# Altium schematic sheet USB Hub.SchDoc: ET4X Full Dock
size A; Date: 12/7/2021; ApprovedBy: KEW; CheckedBy: KEW; Author: KEW; CompanyName: Gamber-Johnson LLC; Engineer: KEW; Organization: Gamber-Johnson LLC; Address1: 5001 Joerns Dr.; Address2: Stevens Point; Address3: WI, 54481; DocumentNumber: TBD; DrawnBy: KEW; RevisionEngineer: KEW; ProjectTitle: USB-OTG Puck; Revision: X2; SheetNumber: 2; SheetTotal: 5; RevisionDescription: Genesys USB2.0 hub; DrawnByDate: 1/18/2023; ProjectNumber: 7150-0297; AssemblyNumber: 7150-0297; RevisionDate: 1/18/2023; SheetTitle: USB Hub; Time: 1:27 PM; Application_BuildNumber: TBD
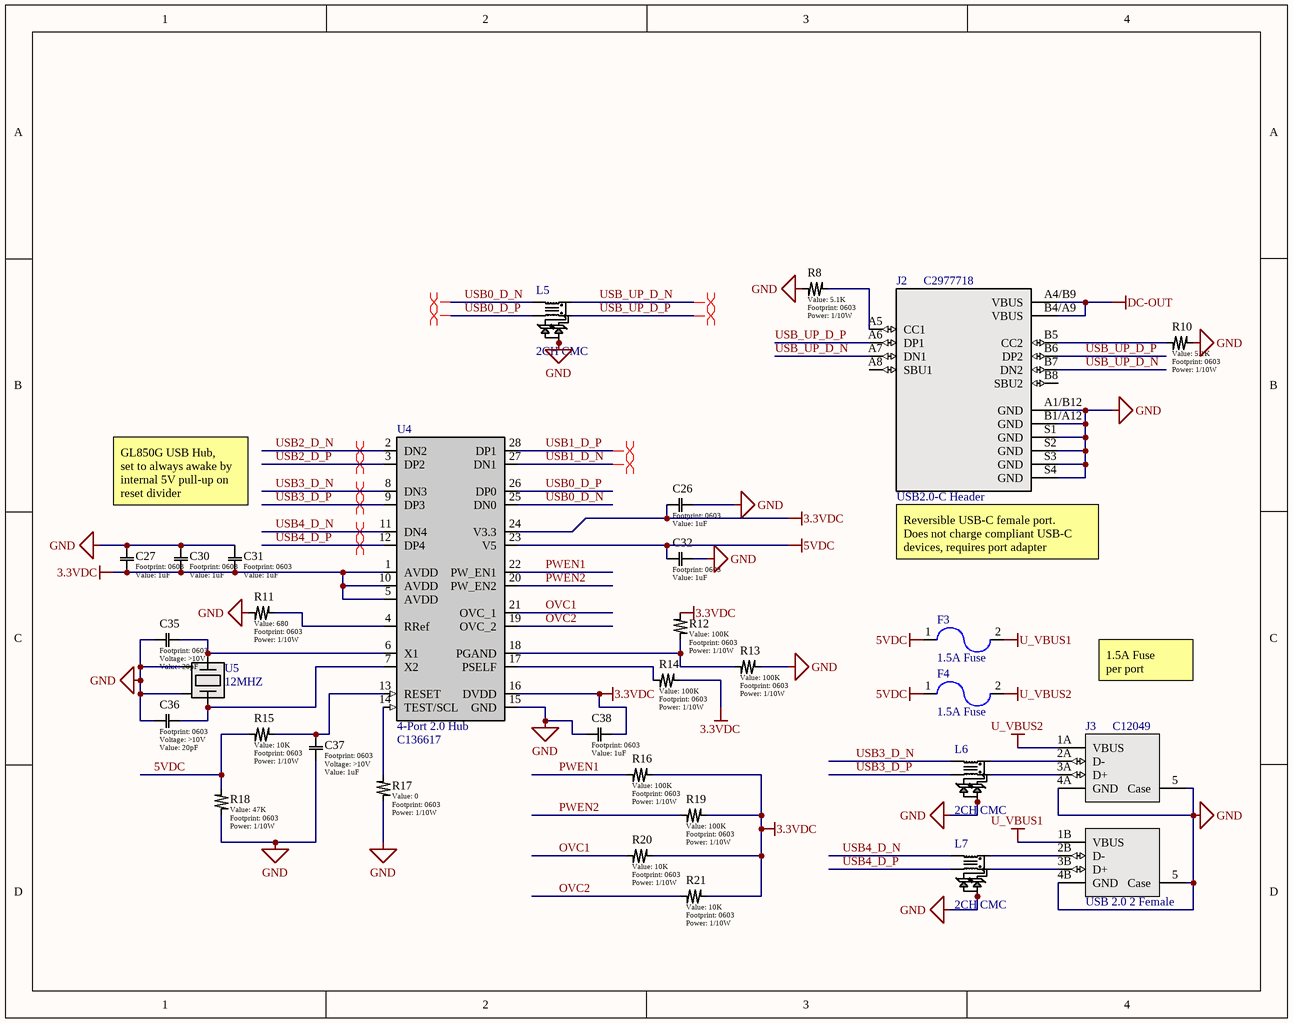
[diagram p0: USB Hub.SchDoc]

## Parts
C26  value 1uF  [0603]  (hidden comment: Generic Capacitor)
C27  value 1uF  [0603]  (hidden comment: Generic Capacitor)
C30  value 1uF  [0603]  (hidden comment: Generic Capacitor)
C31  value 1uF  [0603]  (hidden comment: Generic Capacitor)
C32  value 1uF  [0603]  (hidden comment: Generic Capacitor)
C35  value 20pF  Voltage: >10V  [0603]  (hidden comment: Generic Capacitor)
C36  value 20pF  Voltage: >10V  [0603]  (hidden comment: Generic Capacitor)
C37  value 1uF  Voltage: >10V  [0603]  (hidden comment: Generic Capacitor)
C38  value 1uF  [0603]  (hidden comment: Generic Capacitor)
F3  1.5A Fuse  [1206 Fuse]
F4  1.5A Fuse  [1206 Fuse]
J2  USB2.0-C Header  LCSC PN: C2977718  [USB4110-GF-A]
J3  USB 2.0 2 Female  LCSC PN: C12049  [907-111A1022D10200]
L5  2CH CMC  [SMD-6-2CH]
L6  2CH CMC  [SMD-6-2CH]
L7  2CH CMC  [SMD-6-2CH]
R8  value 5.1K  Power: 1/10W  [0603]  (hidden comment: Generic Resistor)
R10  value 5.1K  Power: 1/10W  [0603]  (hidden comment: Generic Resistor)
R11  value 680  Power: 1/10W  [0603]  (hidden comment: Generic Resistor)
R12  value 100K  Power: 1/10W  [0603]  (hidden comment: Generic Resistor)
R13  value 100K  Power: 1/10W  [0603]  (hidden comment: Generic Resistor)
R14  value 100K  Power: 1/10W  [0603]  (hidden comment: Generic Resistor)
R15  value 10K  Power: 1/10W  [0603]  (hidden comment: Generic Resistor)
R16  value 100K  Power: 1/10W  [0603]  (hidden comment: Generic Resistor)
R17  value 0  Power: 1/10W  [0603]  (hidden comment: Generic Resistor)
R18  value 47K  Power: 1/10W  [0603]  (hidden comment: Generic Resistor)
R19  value 100K  Power: 1/10W  [0603]  (hidden comment: Generic Resistor)
R20  value 10K  Power: 1/10W  [0603]  (hidden comment: Generic Resistor)
R21  value 10K  Power: 1/10W  [0603]  (hidden comment: Generic Resistor)
U4  4-Port 2.0 Hub  LCSC PN: C136617  [GL850G-HHY22]
U5  12MHZ  [SMD2520-4P]

## Nets
3.3VDC: C26.1 C27.1 C30.1 C31.1 C38.2 R12.2 R14.2 R16.2 R19.2 R20.2 R21.2 U4.1(AVDD) U4.5(AVDD) U4.10(AVDD) U4.16(DVDD) U4.24(V3.3)
5VDC: C32.1 F3.1 F4.1 R15.1 R18.1 U4.23(V5)
DC-OUT: J2.A4/B9(VBUS) J2.B4/A9(VBUS)
GND: C26.2 C27.2 C30.2 C31.2 C32.2 C35.2 C36.2 C37.1 C38.1 J2.A1/B12(GND) J2.B1/A12(GND) J2.S1(GND) J2.S2(GND) J2.S3(GND) J2.S4(GND) J3.4A(GND) J3.4B(GND) J3.5(Case) L5.5 L5.6 L6.5 L6.6 L7.5 L7.6 R8.1 R10.2 R11.2 R13.2 R17.2 R18.2 U4.15(GND) U5.2(GND) U5.4(GND)
U_VBUS1: F3.2 J3.1B(VBUS)
U_VBUS2: F4.2 J3.1A(VBUS)
OVC1: R20.1 U4.21(OVC_1)
OVC2: R21.1 U4.19(OVC_2)
PWEN1: R16.1 U4.22(PW_EN1)
PWEN2: R19.1 U4.20(PW_EN2)
USB0_D_N: L5.4 U4.25(DN0)
USB0_D_P: L5.3 U4.26(DP0)
USB1_D_N: U4.27(DN1)
USB1_D_P: U4.28(DP1)
USB2_D_N: U4.2(DN2)
USB2_D_P: U4.3(DP2)
USB3_D_N: L6.4 U4.8(DN3)
USB3_D_P: L6.3 U4.9(DP3)
USB4_D_N: L7.4 U4.11(DN4)
USB4_D_P: L7.3 U4.12(DP4)
USB_UP_D_N: J2.A7(DN1) J2.B7(DN2) L5.1
USB_UP_D_P: J2.A6(DP1) J2.B6(DP2) L5.2
NetC35_1: C35.1 U4.6(X1) U5.1
NetC36_1: C36.1 U4.7(X2) U5.3
NetC37_2: C37.2 R15.2 U4.13(RESET)
NetJ2_A5: J2.A5(CC1) R8.2
NetJ2_B5: J2.B5(CC2) R10.1
NetJ3_2A: J3.2A(D-) L6.1
NetJ3_2B: J3.2B(D-) L7.1
NetJ3_3A: J3.3A(D+) L6.2
NetJ3_3B: J3.3B(D+) L7.2
NetR11_1: R11.1 U4.4(RRef)
NetR12_1: R12.1 R13.1 U4.18(PGAND)
NetR14_1: R14.1 U4.17(PSELF)
NetR17_1: R17.1 U4.14(TEST/SCL)

Not connected (* = marked no-connect by the designer): J2 A8(SBU1) B8(SBU2)

## Layout directives
differential pair: USB0_D_N, USB0_D_P, USB1_D_N, USB1_D_P, USB2_D_N, USB2_D_P, USB3_D_N, USB3_D_P, USB4_D_N, USB4_D_P, USB_UP_D_N, USB_UP_D_P

## Notes on the sheet
- GL850G USB Hub,
  set to always awake by internal 5V pull-up on reset divider
- (near J2) Reversible USB-C female port.
  Does not charge compliant USB-C devices, requires port adapter
- 1.5A Fuse
  per port
- REV
- REVISIONS
- DATE
- DESCRIPTION
- BY
- UNLESS OTHERWISE SPECIFIED, DRAWING DEFINITIONS AND TOLERANCES SHALL BE FOUND UNDER SUPPLIER STANDARDS SS-001. THIS PART AND ALL COMPONENTS OF IT MUST BE RoHS & REACH COMPLIANT. A CERTIFICATE OF COMPLIANCE MUST BE PROVIDED UPON REQUEST.
- ALL INFORMATION ON THIS DOCUMENT IS THE SOLE PROPERTY OF GAMBER-JOHNSON AND SHALL NOT BE COPIED, REPRODUCED, USED OR DISCLOSED IN WHOLE OR IN PART WITHOUT THE WRITTEN CONSENT OF GAMBER-JOHNSON
- TOLERANCES
  .00 ± .060
  .000 ± .020
  .0000 ± .005
  ANGELS ± 1°
- DRAWN BY:
- PROJECT NUMBER:
- SHEET TITLE:
- SHEET
- OF
- DATE:
- LOCATION:
- ASSEMBLY NUMBER
- SIZE
- GAMBER-JOHNSON LLC
  3001 BORHAM AVE.
  STEVENS POINT, WI 54481
  +1 (715) 344-5209
- B

## Library data of the parts
C26 C27 C30-C32 C38 = Generic Capacitor: Voltage: >10V; Tolerance: 10%
C35-C37 = Generic Capacitor: Tolerance: 10%
F3 F4 = ASMD1206-075: 6V 750mA 100A 600mW -40℃~+85℃ 1.5A 90mΩ 200ms 500mΩ 1206 Resettable Fuses ROHS; LCSC PN: C135339
J2 = USB4110-GF-A: USB-C (USB TYPE-C) USB 2.0 Receptacle Connector 24 (16+8 Dummy) Position Surface Mount, Right Angle; Through Hole; Manufacturer 1: Global Connector Technology; Supplier 1: Newark; Manufacturer Part Number 1: USB4110-GF-A; RoHS: No; Pricing 1: 1=1.09000, 10=0.97500, 25=0.90200, 50=0.83800, 100=0.72900, 250=0.66000, 500=0.58700, 1000=0.56700 (USD); Supplier Part Number 1: 86AH2022
J3 = 907-111A1022D10200: USB 2.0 2 8 Female Type-A Plugin USB Connectors ROHS
L5-L7 = ICMEF112P350MFR: 35Ω@100MHz -40℃~+85℃ 4Ω 5V 2 100mA SMD Common Mode Filters ROHS; LCSC PN: C2903682
R8 R10-R21 = Generic Resistor: Tolerance: 1%
U4 = GL850G-HHY22: USB 2.0 Hub Controller
U5 = 7C012000RW1: 12MHz SMD Crystal Resonator 20pF ±10ppm ±20ppm SMD2520-4P Crystals ROHS; LCSC PN: C655059